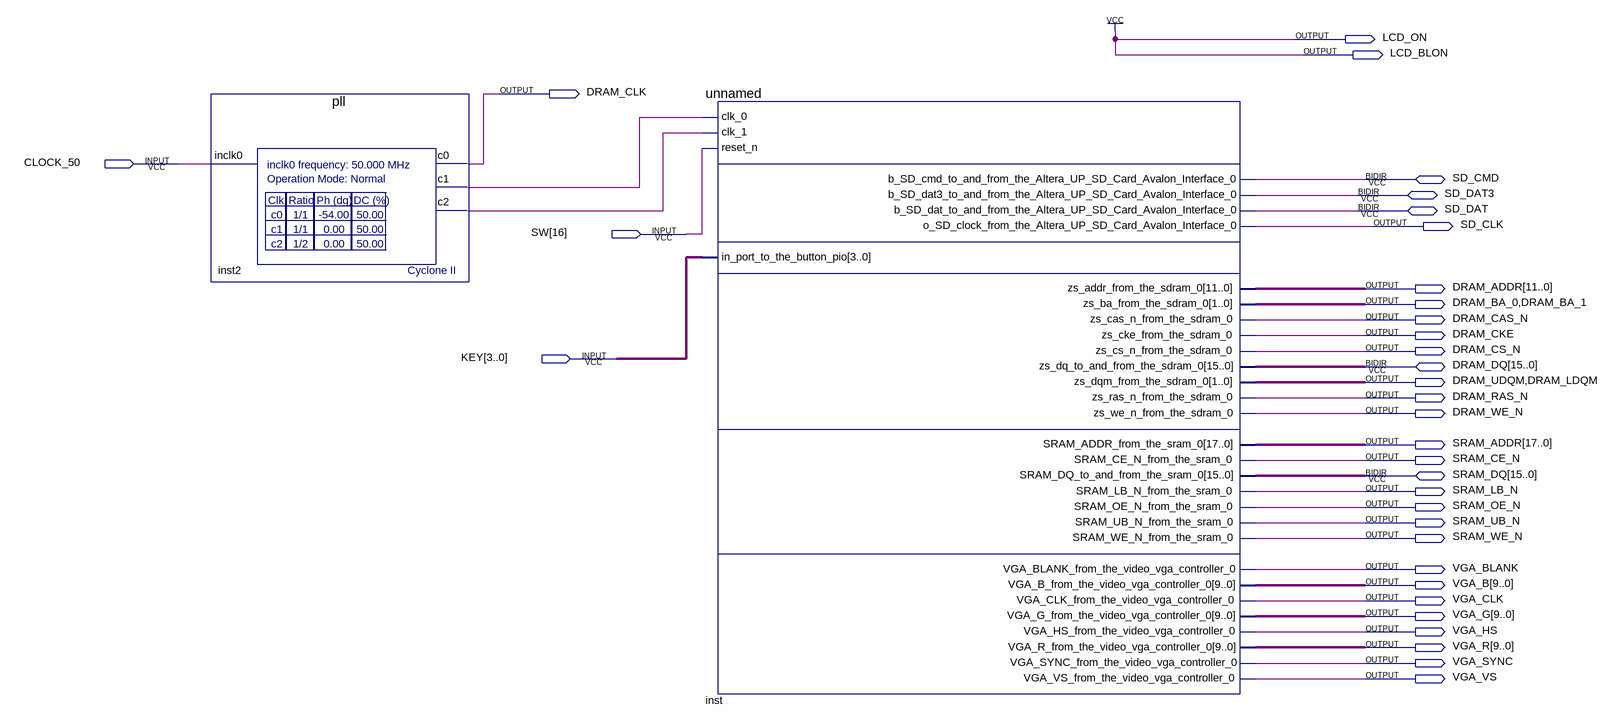
[diagram p0: schematic sheet]
// Quartus schematic ECE423_soc.bdf as structural Verilog: 2 symbols, 34 pins
module ECE423_soc (
  input  CLOCK_50,
  input  [16:16] SW,
  input  [3:0] KEY,
  inout  SD_CMD,
  inout  SD_DAT3,
  inout  SD_DAT,
  inout  [15:0] DRAM_DQ,
  inout  [15:0] SRAM_DQ,
  output LCD_ON,
  output LCD_BLON,
  output DRAM_CLK,
  output SD_CLK,
  output [11:0] DRAM_ADDR,
  output DRAM_BA_0,
  output DRAM_BA_1,
  output DRAM_CAS_N,
  output DRAM_CKE,
  output DRAM_CS_N,
  output DRAM_UDQM,
  output DRAM_LDQM,
  output DRAM_RAS_N,
  output DRAM_WE_N,
  output [17:0] SRAM_ADDR,
  output SRAM_CE_N,
  output SRAM_LB_N,
  output SRAM_OE_N,
  output SRAM_UB_N,
  output SRAM_WE_N,
  output VGA_BLANK,
  output [9:0] VGA_B,
  output VGA_CLK,
  output [9:0] VGA_G,
  output VGA_HS,
  output [9:0] VGA_R,
  output VGA_SYNC,
  output VGA_VS
);

  wire inst2_c1, inst2_c2;

  pll inst2 (.inclk0(CLOCK_50), .c0(DRAM_CLK), .c1(inst2_c1), .c2(inst2_c2));
  unnamed inst (
    .clk_0(inst2_c1), .clk_1(inst2_c2), .reset_n(SW[16]), .in_port_to_the_button_pio(KEY),
    .o_SD_clock_from_the_Altera_UP_SD_Card_Avalon_Interface_0(SD_CLK), .zs_addr_from_the_sdram_0(DRAM_ADDR),
    .zs_ba_from_the_sdram_0({DRAM_BA_0, DRAM_BA_1}), .zs_cas_n_from_the_sdram_0(DRAM_CAS_N),
    .zs_cke_from_the_sdram_0(DRAM_CKE), .zs_cs_n_from_the_sdram_0(DRAM_CS_N),
    .zs_dqm_from_the_sdram_0({DRAM_UDQM, DRAM_LDQM}), .zs_ras_n_from_the_sdram_0(DRAM_RAS_N),
    .zs_we_n_from_the_sdram_0(DRAM_WE_N), .SRAM_ADDR_from_the_sram_0(SRAM_ADDR),
    .SRAM_CE_N_from_the_sram_0(SRAM_CE_N), .SRAM_LB_N_from_the_sram_0(SRAM_LB_N),
    .SRAM_OE_N_from_the_sram_0(SRAM_OE_N), .SRAM_UB_N_from_the_sram_0(SRAM_UB_N),
    .SRAM_WE_N_from_the_sram_0(SRAM_WE_N), .VGA_BLANK_from_the_video_vga_controller_0(VGA_BLANK),
    .VGA_B_from_the_video_vga_controller_0(VGA_B), .VGA_CLK_from_the_video_vga_controller_0(VGA_CLK),
    .VGA_G_from_the_video_vga_controller_0(VGA_G), .VGA_HS_from_the_video_vga_controller_0(VGA_HS),
    .VGA_R_from_the_video_vga_controller_0(VGA_R), .VGA_SYNC_from_the_video_vga_controller_0(VGA_SYNC),
    .VGA_VS_from_the_video_vga_controller_0(VGA_VS),
    .b_SD_cmd_to_and_from_the_Altera_UP_SD_Card_Avalon_Interface_0(SD_CMD),
    .b_SD_dat3_to_and_from_the_Altera_UP_SD_Card_Avalon_Interface_0(SD_DAT3),
    .b_SD_dat_to_and_from_the_Altera_UP_SD_Card_Avalon_Interface_0(SD_DAT),
    .zs_dq_to_and_from_the_sdram_0(DRAM_DQ), .SRAM_DQ_to_and_from_the_sram_0(SRAM_DQ));

  assign LCD_BLON = 1'b1;
  assign LCD_ON = 1'b1;
endmodule
